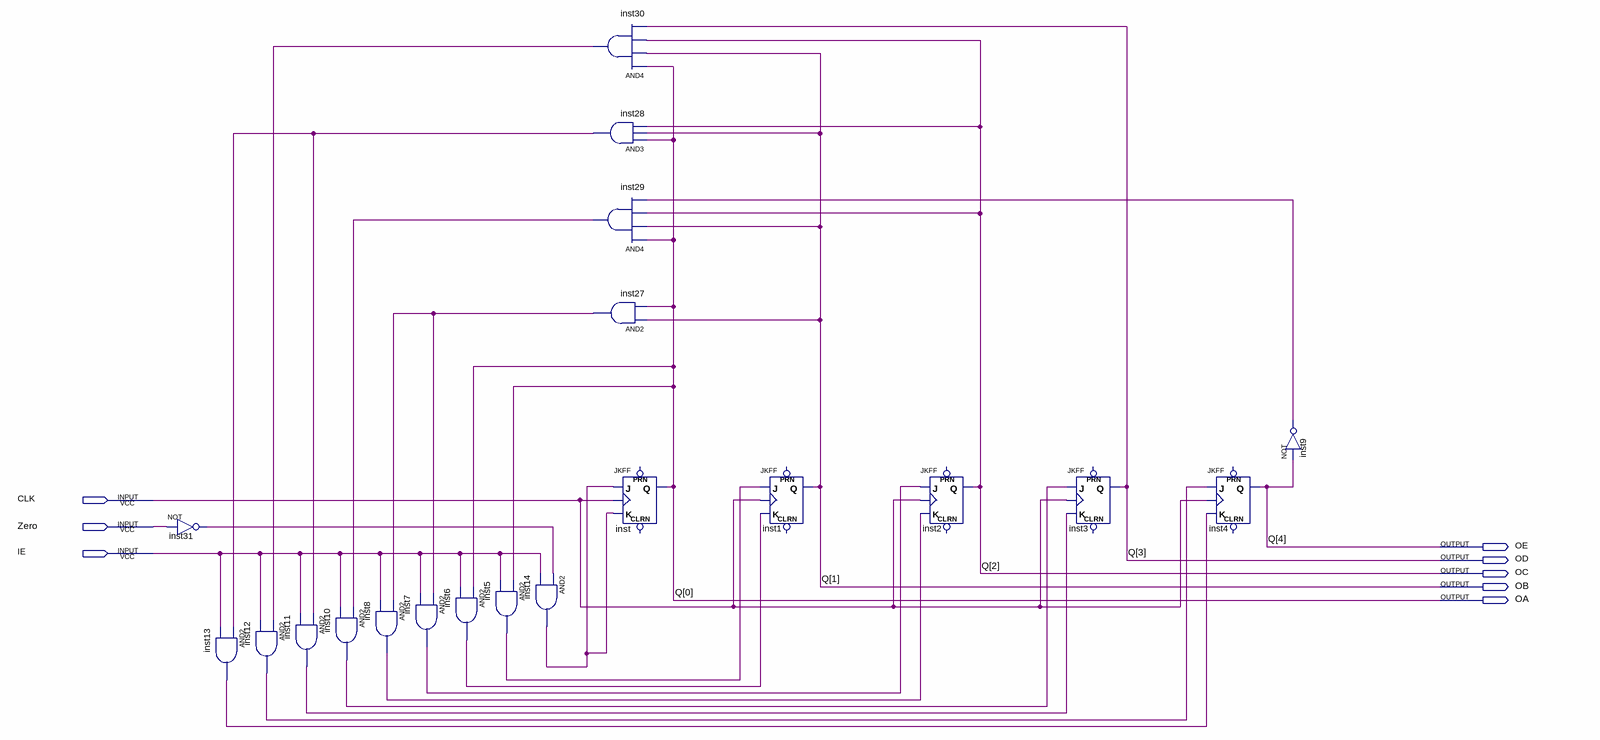
[diagram p0: schematic sheet]
// Quartus schematic mod_24_counter_with_enable.bdf as structural Verilog: 20 symbols, 8 pins
module mod_24_counter_with_enable (
  input  CLK,
  input  Zero,
  input  IE,
  output OE,
  output OD,
  output OC,
  output OB,
  output OA
);

  wire inst5_out, inst6_out, inst7_out, inst8_out, inst9_out, inst10_out, inst11_out, inst12_out, inst13_out,
       inst14_out, inst27_out, inst28_out, inst29_out, inst30_out, inst31_out;

  not inst31 (inst31_out, Zero);
  and inst12 (inst12_out, inst30_out, IE);
  and inst13 (inst13_out, inst28_out, IE);
  and inst11 (inst11_out, inst28_out, IE);
  and inst10 (inst10_out, inst29_out, IE);
  and inst7 (inst7_out, inst27_out, IE);
  and inst8 (inst8_out, inst27_out, IE);
  and inst6 (inst6_out, OA, IE);
  and inst5 (inst5_out, OA, IE);
  and inst14 (inst14_out, inst31_out, IE);
  and inst30 (inst30_out, OA, OB, OC, OD);
  and inst28 (inst28_out, OA, OB, OC);
  and inst29 (inst29_out, OA, OB, OC, inst9_out);
  and inst27 (inst27_out, OB, OA);
  JKFF inst (.K(inst14_out), .J(inst14_out), .CLK(CLK), .Q(OA));  // open: PRN, CLRN
  JKFF inst1 (.K(inst6_out), .J(inst5_out), .CLK(CLK), .Q(OB));  // open: PRN, CLRN
  JKFF inst2 (.K(inst8_out), .J(inst7_out), .CLK(CLK), .Q(OC));  // open: PRN, CLRN
  JKFF inst3 (.K(inst11_out), .J(inst10_out), .CLK(CLK), .Q(OD));  // open: PRN, CLRN
  JKFF inst4 (.K(inst13_out), .J(inst12_out), .CLK(CLK), .Q(OE));  // open: PRN, CLRN
  not inst9 (inst9_out, OE);

  // Other names for the same wires on the sheet: Q[4:0] = {OE, OD, OC, OB, OA}
endmodule
